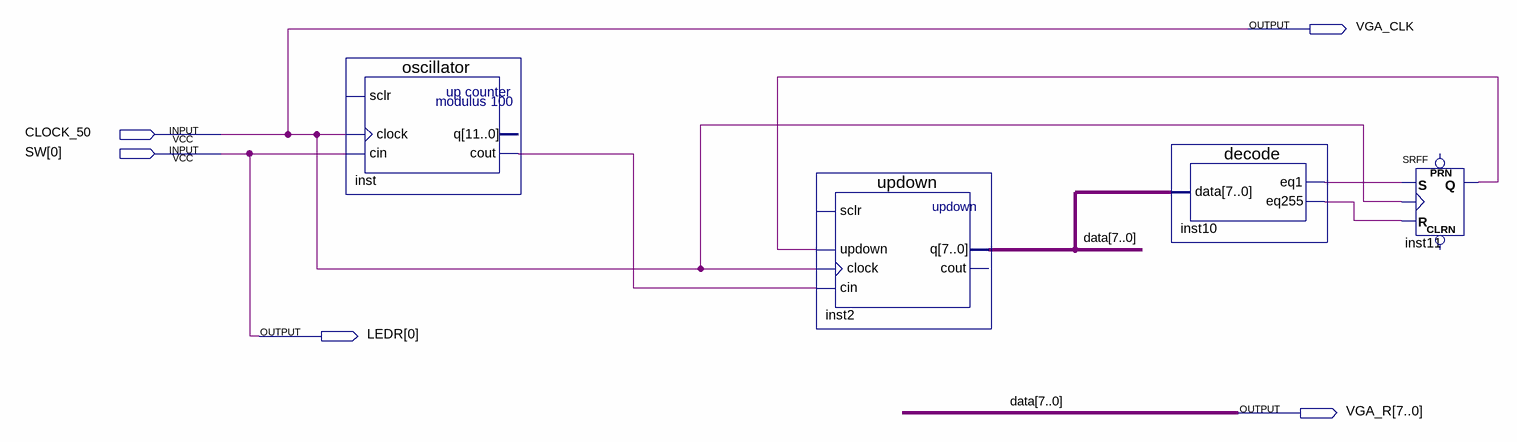
[diagram p0: schematic sheet]
// Quartus schematic TopLevel.bdf as structural Verilog: 4 symbols, 5 pins
module TopLevel (
  input  CLOCK_50,
  input  [0:0] SW,
  output VGA_CLK,
  output [0:0] LEDR,
  output [7:0] VGA_R
);

  wire inst10_eq1, inst10_eq255, inst11_q, inst_cout;

  oscillator inst (.clock(CLOCK_50), .cin(SW[0]), .cout(inst_cout));  // open: sclr, q
  updown inst2 (.updown(inst11_q), .clock(CLOCK_50), .cin(inst_cout), .q(VGA_R));  // open: sclr, cout
  decode inst10 (.data(VGA_R), .eq1(inst10_eq1), .eq255(inst10_eq255));
  SRFF inst11 (.S(inst10_eq1), .R(inst10_eq255), .CLK(CLOCK_50), .Q(inst11_q));  // open: PRN, CLRN

  assign LEDR[0] = SW[0];
  assign VGA_CLK = CLOCK_50;

  // Other names for the same wires on the sheet: data[7:0] = VGA_R
endmodule
